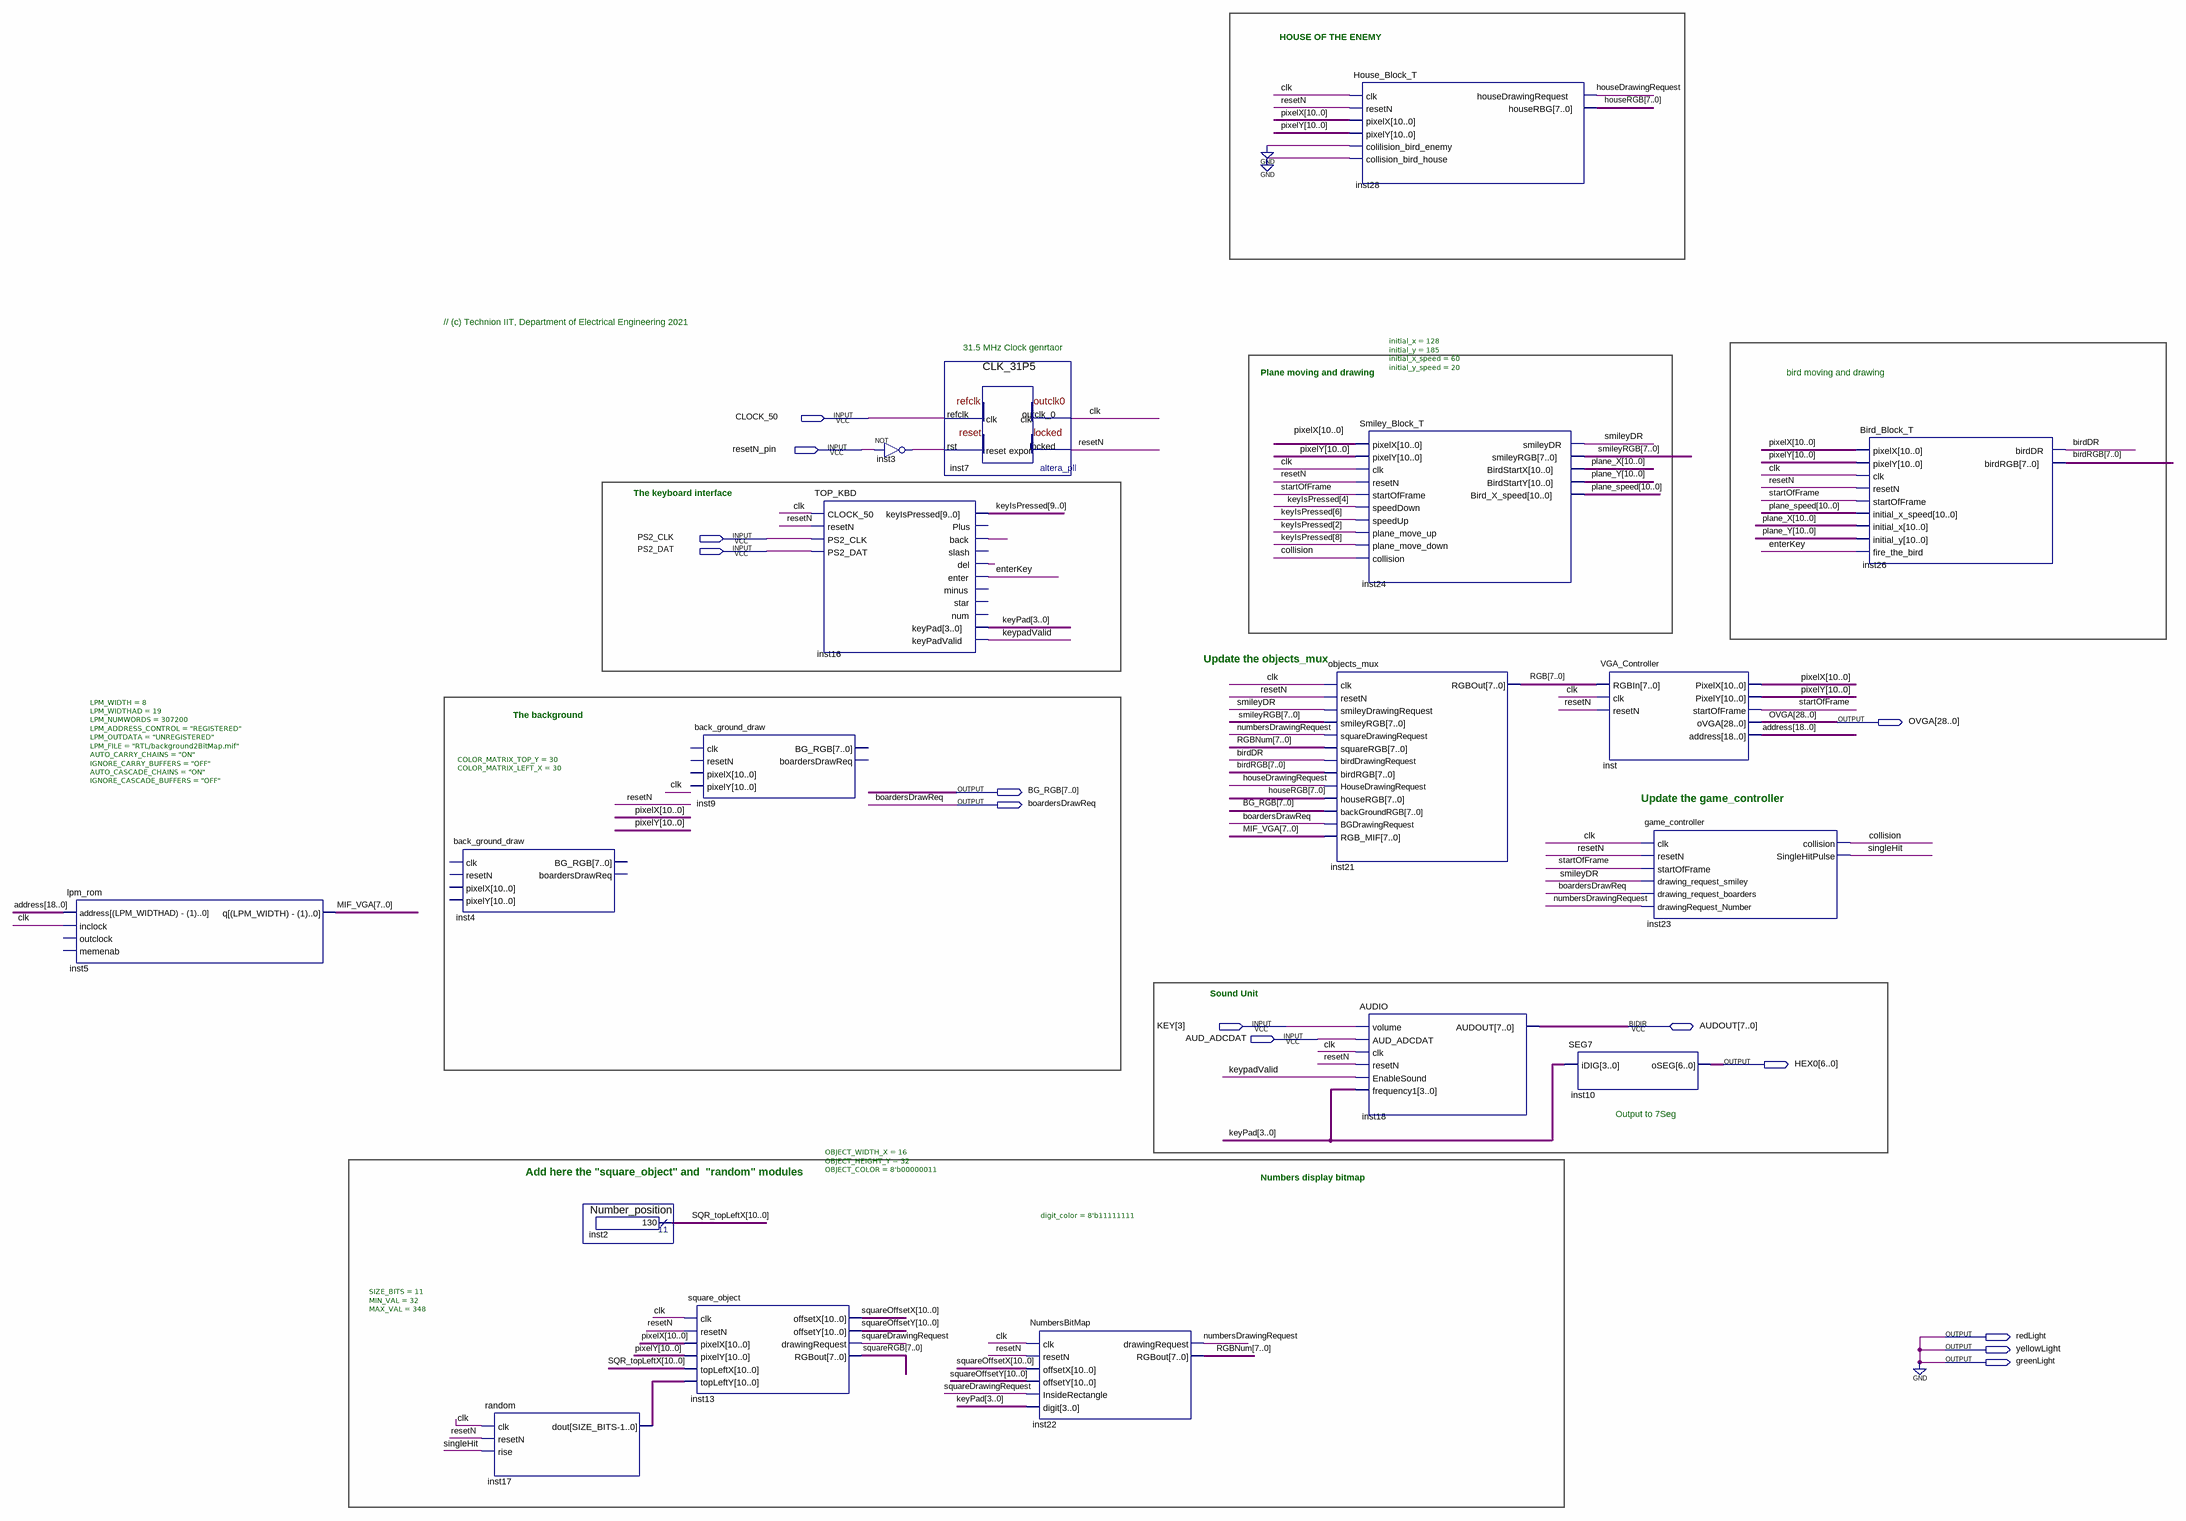
[diagram p0: schematic sheet]
// Quartus schematic TOP_VGA_DEMO_KBD.bdf as structural Verilog: 18 symbols, 14 pins
module TOP_VGA_DEMO_KBD (
  input  CLOCK_50,
  input  resetN_pin,
  input  PS2_CLK,
  input  PS2_DAT,
  input  [3:3] KEY,
  input  AUD_ADCDAT,
  inout  [7:0] AUDOUT,
  output [28:0] OVGA,
  output [7:0] BG_RGB,
  output boardersDrawReq,
  output [6:0] HEX0,
  output redLight,
  output yellowLight,
  output greenLight
);

  wire birdDR, clk, collision, enterKey, houseDrawingRequest, inst3_out, inst16_back, inst16_del,
       keypadValid, numbersDrawingRequest, resetN, singleHit, smileyDR, squareDrawingRequest, startOfFrame;
  wire [3:0] keyPad;
  wire [7:0] birdRGB, houseRGB, MIF_VGA, RGB, RGBNum, smileyRGB, squareRGB;
  wire [9:0] keyIsPressed;
  wire [10:0] inst17_dout, pixelX, pixelY, plane_speed, plane_X, plane_Y, SQR_topLeftX, squareOffsetX,
       squareOffsetY;
  wire [18:0] address;

  lpm_rom #(.LPM_WIDTH(8), .LPM_WIDTHAD(19), .LPM_NUMWORDS(307200), .LPM_ADDRESS_CONTROL("REGISTERED"), .LPM_OUTDATA("UNREGISTERED"), .LPM_FILE("RTL/background2BitMap.mif"), .AUTO_CARRY_CHAINS("ON"), .IGNORE_CARRY_BUFFERS("OFF"), .AUTO_CASCADE_CHAINS("ON"), .IGNORE_CASCADE_BUFFERS("OFF")) inst5 (
    .address(address), .inclock(clk), .q(MIF_VGA));  // open: outclock, memenab
  back_ground_draw #(.COLOR_MATRIX_TOP_Y(30), .COLOR_MATRIX_LEFT_X(30)) inst4 ();  // open: clk, resetN, pixelX, pixelY, BG_RGB, boardersDrawReq
  random #(.SIZE_BITS(11), .MIN_VAL(32), .MAX_VAL(348)) inst17 (
    .clk(clk), .resetN(resetN), .rise(singleHit), .dout(inst17_dout));
  Number_position inst2 (.result(SQR_topLeftX));
  square_object #(.OBJECT_WIDTH_X(16), .OBJECT_HEIGHT_Y(32), .OBJECT_COLOR(8'b00000011)) inst13 (
    .clk(clk), .resetN(resetN), .pixelX(pixelX), .pixelY(pixelY), .topLeftX(SQR_topLeftX),
    .topLeftY(inst17_dout), .offsetX(squareOffsetX), .offsetY(squareOffsetY),
    .drawingRequest(squareDrawingRequest), .RGBout(squareRGB));
  back_ground_draw inst9 ();  // open: clk, resetN, pixelX, pixelY, BG_RGB, boardersDrawReq
  TOP_KBD inst16 (
    .CLOCK_50(clk), .resetN(resetN), .PS2_CLK(PS2_CLK), .PS2_DAT(PS2_DAT), .keyIsPressed(keyIsPressed),
    .back(inst16_back), .del(inst16_del), .enter(enterKey), .keyPad(keyPad), .keyPadValid(keypadValid));  // open: Plus, slash, minus, star, num
  not inst3 (inst3_out, resetN_pin);
  CLK_31P5 inst7 (.refclk(CLOCK_50), .rst(inst3_out), .outclk_0(clk), .locked(resetN));
  NumbersBitMap #(.digit_color(8'b11111111)) inst22 (
    .clk(clk), .resetN(resetN), .offsetX(squareOffsetX), .offsetY(squareOffsetY),
    .InsideRectangle(squareDrawingRequest), .digit(keyPad), .drawingRequest(numbersDrawingRequest),
    .RGBout(RGBNum));
  objects_mux inst21 (
    .clk(clk), .resetN(resetN), .smileyDrawingRequest(smileyDR), .smileyRGB(smileyRGB),
    .squareDrawingRequest(numbersDrawingRequest), .squareRGB(RGBNum), .birdDrawingRequest(birdDR),
    .birdRGB(birdRGB), .HouseDrawingRequest(houseDrawingRequest), .houseRGB(houseRGB),
    .backGroundRGB(BG_RGB), .BGDrawingRequest(boardersDrawReq), .RGB_MIF(MIF_VGA), .RGBOut(RGB));
  House_Block_T inst28 (
    .clk(clk), .resetN(resetN), .pixelX(pixelX), .pixelY(pixelY), .colilision_bird_enemy(1'b0),
    .collision_bird_house(1'b0), .houseDrawingRequest(houseDrawingRequest), .houseRBG(houseRGB));
  Smiley_Block_T #(.initial_x(128), .initial_y(185), .initial_x_speed(60), .initial_y_speed(20)) inst24 (
    .pixelX(pixelX), .pixelY(pixelY), .clk(clk), .resetN(resetN), .startOfFrame(startOfFrame),
    .speedDown(keyIsPressed[4]), .speedUp(keyIsPressed[6]), .plane_move_up(keyIsPressed[2]),
    .plane_move_down(keyIsPressed[8]), .collision(collision), .smileyDR(smileyDR), .smileyRGB(smileyRGB),
    .BirdStartX(plane_X), .BirdStartY(plane_Y), .Bird_X_speed(plane_speed));
  AUDIO inst18 (
    .volume(KEY[3]), .AUD_ADCDAT(AUD_ADCDAT), .clk(clk), .resetN(resetN), .EnableSound(keypadValid),
    .frequency1(keyPad), .AUDOUT(AUDOUT));
  VGA_Controller inst (
    .RGBIn(RGB), .clk(clk), .resetN(resetN), .PixelX(pixelX), .PixelY(pixelY), .startOfFrame(startOfFrame),
    .oVGA(OVGA), .address(address));
  SEG7 inst10 (.iDIG(keyPad), .oSEG(HEX0));
  game_controller inst23 (
    .clk(clk), .resetN(resetN), .startOfFrame(startOfFrame), .drawing_request_smiley(smileyDR),
    .drawing_request_boarders(boardersDrawReq), .drawingRequest_Number(numbersDrawingRequest),
    .collision(collision), .SingleHitPulse(singleHit));
  Bird_Block_T inst26 (
    .pixelX(pixelX), .pixelY(pixelY), .clk(clk), .resetN(resetN), .startOfFrame(startOfFrame),
    .initial_x_speed(plane_speed), .initial_x(plane_X), .initial_y(plane_Y), .fire_the_bird(enterKey),
    .birdDR(birdDR), .birdRGB(birdRGB));

  assign greenLight = 1'b0;
  assign redLight = 1'b0;
  assign yellowLight = 1'b0;

  // Notes on the sheet:
  //   HOUSE OF THE ENEMY
  //   // (c) Technion IIT, Department of Electrical Engineering 2021
  //   31.5 MHz Clock genrtaor
  //   Plane moving and drawing
  //   bird moving and drawing
  //   The keyboard interface
  //   Update the objects_mux
  //   The background
  //   Update the game_controller
  //   Sound Unit
  //   Output to 7Seg
  //   Add here the "square_object" and  "random" modules
  //   Numbers display bitmap
endmodule
